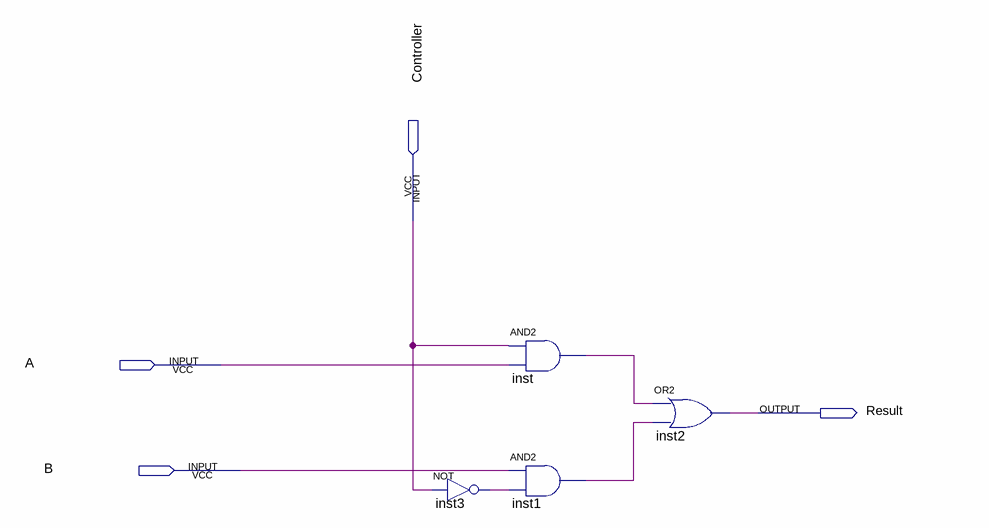
[diagram p0: schematic sheet]
// Quartus schematic MuxInverter.bdf as structural Verilog: 4 symbols, 4 pins
module MuxInverter (
  input  Controller,
  input  A,
  input  B,
  output Result
);

  wire inst1_out, inst3_out, inst_out;

  not inst3 (inst3_out, Controller);
  and inst (inst_out, Controller, A);
  and inst1 (inst1_out, B, inst3_out);
  or inst2 (Result, inst_out, inst1_out);
endmodule
